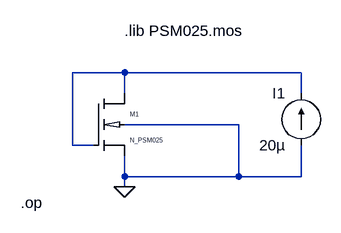
[diagram p0: schematic operating_point_nmos.asc]
operating_point_nmos.asc, the LTspice schematic file:
Version 4
SHEET 1 880 680
WIRE 128 64 48 64
WIRE 400 64 128 64
WIRE 128 96 128 64
WIRE 400 96 400 64
WIRE 304 144 128 144
WIRE 48 176 48 64
WIRE 80 176 48 176
WIRE 128 224 128 192
WIRE 304 224 304 144
WIRE 304 224 128 224
WIRE 400 224 400 176
WIRE 400 224 304 224
WIRE 128 240 128 224
FLAG 128 240 0
SYMBOL current 400 176 R180
WINDOW 0 24 80 Left 2
WINDOW 3 24 0 Left 2
WINDOW 123 0 0 Left 2
WINDOW 39 0 0 Left 2
SYMATTR InstName I1
SYMATTR Value 20µ
SYMBOL N_PSM025 80 96 R0
SYMATTR InstName M1
SYMATTR Value2 l=1u w=5.22u
TEXT -32 264 Left 2 !.op
TEXT 128 0 Left 2 !.lib PSM025.mos

The netlist it stands for:
* operating_point_nmos.asc
I1 0 N001 20µ
M1 N001 N001 0 0 N_PSM025 l=1u w=5.22u
.model NMOS NMOS
.model PMOS PMOS
.lib standard.mos
.op
.lib PSM025.mos
.lib PSM025.mos
.backanno
.end